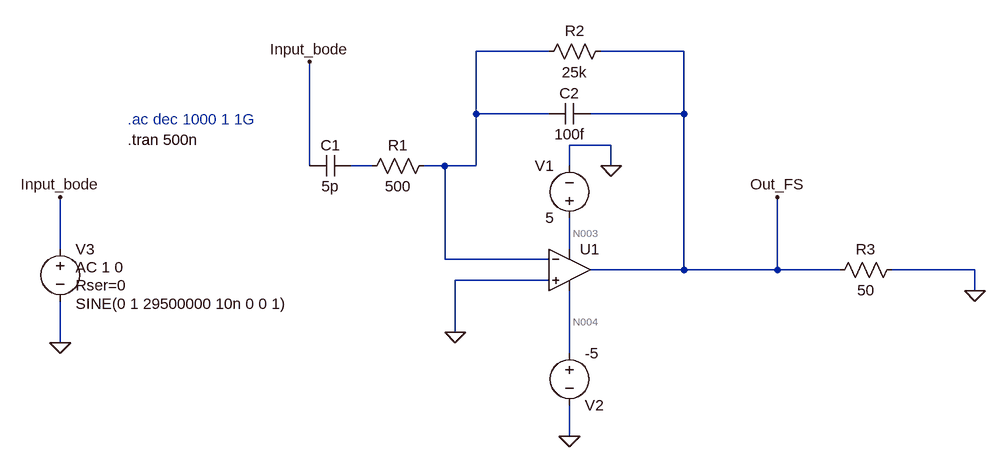
[diagram p0: schematic fastshaper_v1.5.asc]
fastshaper_v1.5.asc, the LTspice schematic file:
Version 4
SHEET 1 880 680
WIRE 0 -32 -112 -32
WIRE 208 -32 80 -32
WIRE -112 64 -112 -32
WIRE 0 64 -112 64
WIRE 208 64 208 -32
WIRE 208 64 64 64
WIRE 96 112 32 112
WIRE -368 144 -368 -16
WIRE -272 144 -304 144
WIRE -160 144 -192 144
WIRE -112 144 -112 64
WIRE -112 144 -160 144
WIRE 32 144 32 112
WIRE 96 144 96 112
WIRE -752 272 -752 192
WIRE 32 272 32 224
WIRE -160 288 -160 144
WIRE 0 288 -160 288
WIRE 208 304 208 64
WIRE 208 304 64 304
WIRE 352 304 352 192
WIRE 352 304 208 304
WIRE 448 304 352 304
WIRE 656 304 528 304
WIRE 0 320 -144 320
WIRE 656 336 656 304
WIRE -144 400 -144 320
WIRE -752 416 -752 352
WIRE 32 432 32 336
WIRE 32 560 32 512
FLAG 96 144 0
FLAG -144 400 0
FLAG 352 192 Out_FS
FLAG 656 336 0
FLAG 32 560 0
FLAG -752 416 0
FLAG -752 192 Input_bode
FLAG -368 -16 Input_bode
SYMBOL res -176 128 R90
WINDOW 0 0 56 VBottom 2
WINDOW 3 32 56 VTop 2
SYMATTR InstName R1
SYMATTR Value 500
SYMBOL res 96 -48 R90
WINDOW 0 0 56 VBottom 2
WINDOW 3 32 56 VTop 2
SYMATTR InstName R2
SYMATTR Value 25k
SYMBOL voltage 32 240 R180
WINDOW 0 24 96 Left 2
WINDOW 3 24 16 Left 2
WINDOW 123 0 0 Left 0
WINDOW 39 0 0 Left 0
SYMATTR InstName V1
SYMATTR Value 5
SYMBOL OpAmps\\UniversalOpAmp1 32 304 R0
SYMATTR InstName U1
SYMATTR Value2 Avol=1900 GBW=897.0831Meg Vos=0
SYMBOL res 544 288 R90
WINDOW 0 0 56 VBottom 2
WINDOW 3 32 56 VTop 2
SYMATTR InstName R3
SYMATTR Value 50
SYMBOL cap -304 128 R90
WINDOW 0 0 32 VBottom 2
WINDOW 3 32 32 VTop 2
SYMATTR InstName C1
SYMATTR Value 5p
SYMBOL cap 64 48 R90
WINDOW 0 0 32 VBottom 2
WINDOW 3 32 32 VTop 2
SYMATTR InstName C2
SYMATTR Value 100f
SYMBOL voltage 32 416 R0
WINDOW 0 24 96 Left 2
WINDOW 3 24 16 Left 2
WINDOW 123 0 0 Left 0
WINDOW 39 0 0 Left 0
SYMATTR InstName V2
SYMATTR Value -5
SYMBOL voltage -752 256 R0
WINDOW 123 24 44 Left 2
WINDOW 39 24 72 Left 2
WINDOW 3 24 100 Left 2
SYMATTR Value2 AC 1 0
SYMATTR SpiceLine Rser=0
SYMATTR Value SINE(0 1 29500000 10n 0 0 1)
SYMATTR InstName V3
TEXT -648 104 Left 2 !.tran 500n
TEXT -648 72 Left 2 ;.ac dec 1000 1 1G

The netlist it stands for:
* fastshaper_v1.5.asc
R1 N001 N002 500
R2 Out_FS N001 25k
V1 N003 0 5
XU1 0 N001 N003 N004 Out_FS level1 Avol=1900 GBW=897.0831Meg Vos=0 En=0 Enk=0 In=0 Ink=0 Rin=500Meg  ; pins In+ In- V+ V- OUT
R3 0 Out_FS 50
C1 N002 Input_bode 5p
C2 Out_FS N001 100f
V2 N004 0 -5
V3 Input_bode 0 SINE(0 1 29500000 10n 0 0 1) AC 1 0 Rser=0
.tran 500n
* .ac dec 1000 1 1G
.lib UniversalOpAmp1.lib
.backanno
.end

* Results of the author's LTspice run, read from the files saved beside the schematic
* Operating Point, zero values left out:
*   V(n003) = 5 V
*   V(n004) = -5 V
*   I(V1) = -10 nA
*   I(V2) = 10 nA
*   Ix(u1:3) = 10 nA
*   Ix(u1:4) = -10 nA
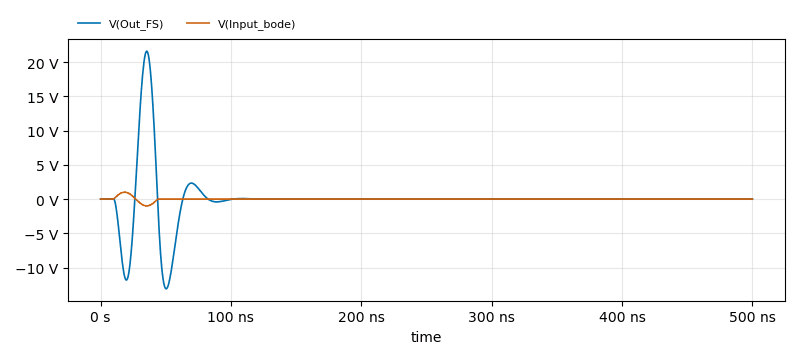
[diagram p1: Transient Analysis of fastshaper_v1.5.asc, plotted from the saved traces]
* Transient Analysis, 1 run:
*   V(Out_FS): min -13.11 V, max 21.58 V, average 53.89 µV, rms 3.623 V, last 0 V
*   V(Input_bode): min -999.2 mV, max 999.7 mV, average -6.735 µV, rms 184.1 mV, last 0 V